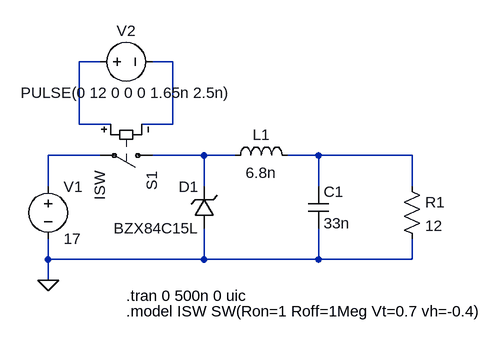
[diagram p0: schematic LVDC Power Supply.asc]
LVDC Power Supply.asc, the LTspice schematic file:
Version 4
SHEET 1 880 680
WIRE 96 -64 64 -64
WIRE 208 -64 176 -64
WIRE 64 32 64 -64
WIRE 112 32 64 32
WIRE 208 32 208 -64
WIRE 208 32 160 32
WIRE 96 80 16 80
WIRE 256 80 176 80
WIRE 304 80 256 80
WIRE 432 80 384 80
WIRE 576 80 432 80
WIRE 16 128 16 80
WIRE 256 128 256 80
WIRE 432 128 432 80
WIRE 576 128 576 80
WIRE 16 240 16 208
WIRE 256 240 256 192
WIRE 256 240 16 240
WIRE 432 240 432 192
WIRE 432 240 256 240
WIRE 576 240 576 208
WIRE 576 240 432 240
WIRE 16 272 16 240
FLAG 16 272 0
SYMBOL voltage 16 112 R0
WINDOW 123 0 0 Left 0
WINDOW 39 0 0 Left 0
SYMATTR InstName V1
SYMATTR Value 17
SYMBOL ind 288 96 R270
WINDOW 0 32 56 VTop 2
WINDOW 3 5 56 VBottom 2
SYMATTR InstName L1
SYMATTR Value 6.8n
SYMBOL cap 416 128 R0
SYMATTR InstName C1
SYMATTR Value 33n
SYMBOL res 560 112 R0
SYMATTR InstName R1
SYMATTR Value 12
SYMBOL zener 272 192 R180
WINDOW 0 24 64 Left 2
WINDOW 3 24 0 Left 2
SYMATTR InstName D1
SYMATTR Value BZX84C15L
SYMATTR Description Diode
SYMATTR Type diode
SYMBOL sw 192 80 R90
SYMATTR InstName S1
SYMATTR Value ISW
SYMBOL voltage 80 -64 R270
WINDOW 0 32 56 VTop 2
WINDOW 3 -32 56 VBottom 2
WINDOW 123 0 0 Left 0
WINDOW 39 0 0 Left 0
SYMATTR InstName V2
SYMATTR Value PULSE(0 12 0 0 0 1.65n 2.5n)
TEXT 136 296 Left 2 !.tran 0 500n 0 uic
TEXT 136 320 Left 2 !.model ISW SW(Ron=1 Roff=1Meg Vt=0.7 vh=-0.4)

The netlist it stands for:
* LVDC Power Supply.asc
V1 N003 0 17
L1 N004 N005 6.8n
C1 N005 0 33n
R1 N005 0 12
D1 0 N004 BZX84C15L
S1 N004 N003 N001 N002 ISW
V2 N001 N002 PULSE(0 12 0 0 0 1.65n 2.5n)
.model D D
.lib standard.dio
.tran 0 500n 0 uic
.model ISW SW(Ron=1 Roff=1Meg Vt=0.7 vh=-0.4)
.backanno
.end